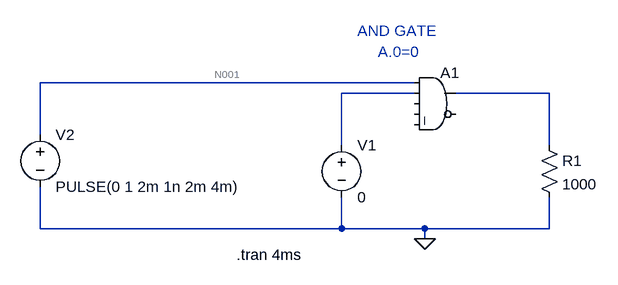
[diagram p0: schematic 4_A_dot_0_equal_0.asc]
4_A_dot_0_equal_0.asc, the LTspice schematic file:
Version 4
SHEET 1 880 680
WIRE 288 16 -288 16
WIRE 288 32 176 32
WIRE 496 32 352 32
WIRE -288 96 -288 16
WIRE 176 112 176 32
WIRE 496 112 496 32
WIRE -288 240 -288 176
WIRE 176 240 176 192
WIRE 176 240 -288 240
WIRE 304 240 176 240
WIRE 496 240 496 192
WIRE 496 240 304 240
WIRE 304 256 304 240
FLAG 304 256 0
SYMBOL voltage 176 96 R0
SYMATTR InstName V1
SYMATTR Value 0
SYMBOL voltage -288 80 R0
WINDOW 123 0 0 Left 0
WINDOW 39 0 0 Left 0
SYMATTR InstName V2
SYMATTR Value PULSE(0 1 2m 1n 2m 4m)
SYMBOL res 480 96 R0
SYMATTR InstName R1
SYMATTR Value 1000
SYMBOL Digital\\and 320 -16 R0
SYMATTR InstName A1
TEXT 200 -64 Left 2 ;AND GATE
TEXT 14 280 Left 2 !.tran 4ms
TEXT 232 -32 Left 2 ;A.0=0

The netlist it stands for:
* 4_A_dot_0_equal_0.asc
V1 N002 0 0
V2 N001 0 PULSE(0 1 2m 1n 2m 4m)
R1 N003 0 1000
A1 N001 N002 0 0 0 0 N003 0 AND
* AND GATE
.tran 4ms
* A.0=0
.backanno
.end

* Results of the author's LTspice run, read from the files saved beside the schematic
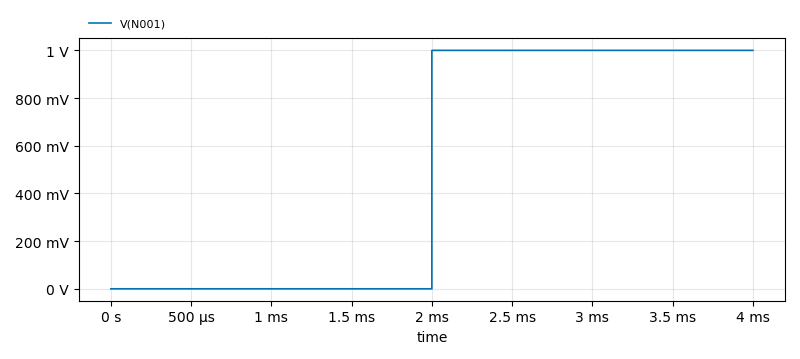
[diagram p1: Transient Analysis of 4_A_dot_0_equal_0.asc, plotted from the saved traces]
* Transient Analysis, 1 run:
*   V(N001): min 0 V, max 1 V, average 500 mV, rms 707.1 mV, last 1 V